# Altium schematic sheet RobotCtrl_V2_Mother-board.SchDoc
size A3; Author: Power Lin; DocumentNumber: 1; SheetNumber: 1; SheetTotal: 1; Website: wiki-power.com
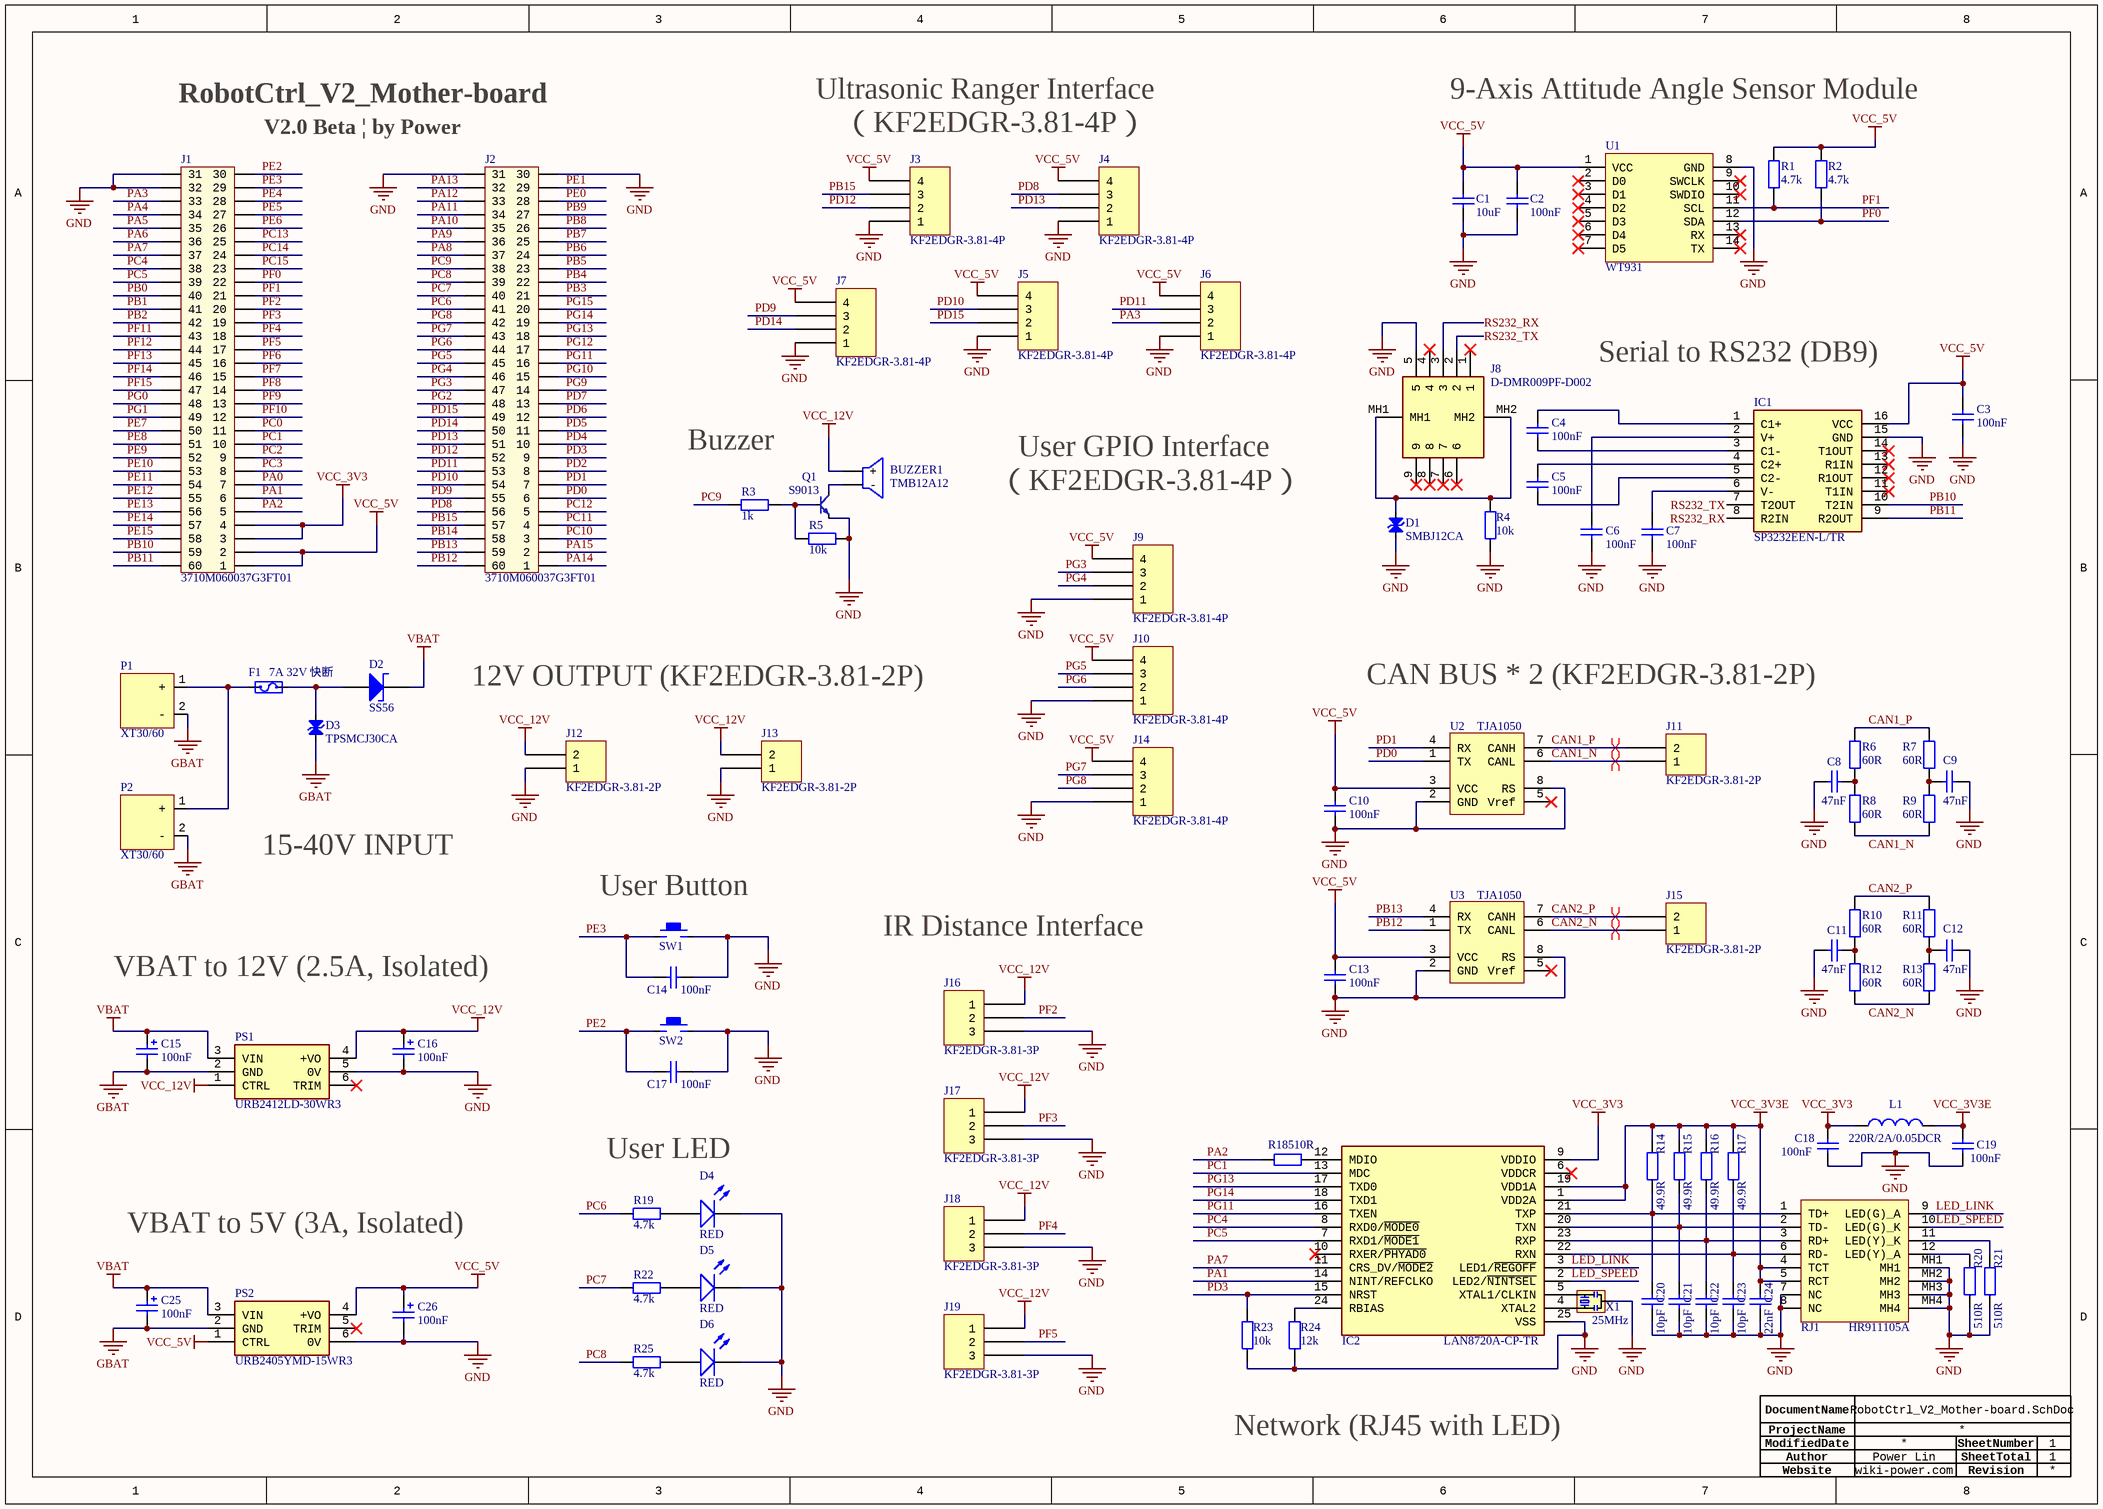
[diagram p0: RobotCtrl_V2_Mother-board.SchDoc]

## Parts
BUZZER1  TMB12A12  [DIP,P=7.6mm]
C1  10uF  [CAP-0603]
C2  100nF  [CAP-0603]
C3  100nF  [CAP-0603]
C4  100nF  [CAP-0603]
C5  100nF  [CAP-0603]
C6  100nF  [CAP-0603]
C7  100nF  [CAP-0603]
C8  47nF  [CAP-0603]
C9  47nF  [CAP-0603]
C10  100nF  [CAP-0603]
C11  47nF  [CAP-0603]
C12  47nF  [CAP-0603]
C13  100nF  [CAP-0603]
C14  100nF  [CAP-0603]
C15  100nF  [CAP-AUX-3216]
C16  100nF  [CAP-AUX-3216]
C17  100nF  [CAP-0603]
C18  100nF  [CAP-0603]
C19  100nF  [CAP-0603]
C20  10pF  [CAP-0603]
C21  10pF  [CAP-0603]
C22  10pF  [CAP-0603]
C23  10pF  [CAP-0603]
C24  22nF  [CAP-0603]
C25  100nF  [CAP-AUX-3216]
C26  100nF  [CAP-AUX-3216]
D1  SMBJ12CA  [DO-214AA/SMB]
D2  SS56  [DO-214AB/SMC]
D3  TPSMCJ30CA  [DO-214AB/SMC]
D4  RED  [LED-0603]
D5  RED  [LED-0603]
D6  RED  [LED-0603]
F1  7A 32V 快断  [FUSE_1206]
IC1  SP3232EEN-L/TR  [SOIC-16_150mil]
IC2  LAN8720A-CP-TR  [QFN-24-4x4]
J1  3710M060037G3FT01  [3710M060037G3FT01]
J2  3710M060037G3FT01  [3710M060037G3FT01]
J3  KF2EDGR-3.81-4P  [FCI 06-381-4PIN]
J4  KF2EDGR-3.81-4P  [FCI 06-381-4PIN]
J5  KF2EDGR-3.81-4P  [FCI 06-381-4PIN]
J6  KF2EDGR-3.81-4P  [FCI 06-381-4PIN]
J7  KF2EDGR-3.81-4P  [FCI 06-381-4PIN]
J8  D-DMR009PF-D002  [Through Hole,P=2.77mm]
J9  KF2EDGR-3.81-4P  [FCI 06-381-4PIN]
J10  KF2EDGR-3.81-4P  [FCI 06-381-4PIN]
J11  KF2EDGR-3.81-2P  [FCI 06-381-2PIN]
J12  KF2EDGR-3.81-2P  [FCI 06-381-2PIN]
J13  KF2EDGR-3.81-2P  [FCI 06-381-2PIN]
J14  KF2EDGR-3.81-4P  [FCI 06-381-4PIN]
J15  KF2EDGR-3.81-2P  [FCI 06-381-2PIN]
J16  KF2EDGR-3.81-3P  [FCI 06-381-3PIN]
J17  KF2EDGR-3.81-3P  [FCI 06-381-3PIN]
J18  KF2EDGR-3.81-3P  [FCI 06-381-3PIN]
J19  KF2EDGR-3.81-3P  [FCI 06-381-3PIN]
L1  220R/2A/0.05DCR  [L-0603]
P1  XT30/60  [XT60PW-M]
P2  XT30/60  [XT60PW-M]
PS1  URB2412LD-30WR3  [URB2412LD30WR3]
PS2  URB2405YMD-15WR3  [URB2405YMD15WR3]
Q1  S9013  [SOT-23-3]
R1  4.7k  [R-0603]
R2  4.7k  [R-0603]
R3  1k  [R-0603]
R4  10k  [R-0603]
R5  10k  [R-0603]
R6  60R  [R-0603]
R7  60R  [R-0603]
R8  60R  [R-0603]
R9  60R  [R-0603]
R10  60R  [R-0603]
R11  60R  [R-0603]
R12  60R  [R-0603]
R13  60R  [R-0603]
R14  49.9R  [R-0603]
R15  49.9R  [R-0603]
R16  49.9R  [R-0603]
R17  49.9R  [R-0603]
R18  510R  [R-0603]
R19  4.7k  [R-0603]
R20  510R  [R-0603]
R21  510R  [R-0603]
R22  4.7k  [R-0603]
R23  10k  [R-0603]
R24  12k  [R-0603]
R25  4.7k  [R-0603]
RJ1  HR911105A  [HR911105A]
SW1  KEY  [KEY-4P-4.2*3.4*2.5]  (value not drawn)
SW2  KEY  [KEY-4P-4.2*3.4*2.5]  (value not drawn)
U1  WT931  [WT931]
U2  TJA1050  [SOIC_8]
U3  TJA1050  [SOIC_8]
X1  25MHz  [SMD3213-3P]

## Nets
GBAT: C15.2 C25.2 D3.1 P1.2(-) P2.2(-) PS1.2(GND) PS2.2(GND)
GND: C1.2 C2.2 C3.1 C6.1 C7.1 C8.2 C9.2 C10.1 C11.2 C12.2 C13.1 C14.1 C16.2 C17.1 C18.1 C19.1 C20.1 C21.1 C22.1 C23.1 C24.1 C26.2 D1.1 D4.K D5.K D6.K IC1.15(GND) IC2.25(VSS) J1.31 J1.32 J2.30 J2.31 J3.1 J4.1 J5.1 J6.1 J7.1 J8.5 J9.1 J10.1 J12.1 J13.1 J14.1 J16.3 J17.3 J18.3 J19.3 PS1.5(0V) PS2.6(0V) Q1.2(E) R4.1 R5.1 R20.1 R21.1 R23.2 R24.2 RJ1.7(NC) RJ1.8(NC) RJ1.MH1 RJ1.MH2 RJ1.MH3 RJ1.MH4 SW1.2 SW2.2 U1.8(GND) U2.2(GND) U2.8(RS) U3.2(GND) U3.8(RS) X1.2(GND)
VBAT: C15.1 C25.1 D2.2(K) PS1.3(VIN) PS2.3(VIN)
VCC_3V3: C18.2 IC2.9(VDDIO) J1.3 J1.4 L1.1
VCC_3V3E: C19.2 C24.2 IC2.1(VDD2A) IC2.19(VDD1A) L1.2 R14.2 R15.2 R16.2 R17.2 RJ1.4(TCT) RJ1.5(RCT)
VCC_5V: C1.1 C2.1 C3.2 C10.2 C13.2 C26.1 IC1.16(VCC) J1.1 J1.2 J3.4 J4.4 J5.4 J6.4 J7.4 J9.4 J10.4 J14.4 PS2.1(CTRL) PS2.4(+VO) R1.2 R2.2 U1.1(VCC) U2.3(VCC) U3.3(VCC)
VCC_12V: BUZZER1.1(+) C16.1 J12.2 J13.2 J16.1 J17.1 J18.1 J19.1 PS1.1(CTRL) PS1.4(+VO)
CAN1_N: J11.1 R8.2 R9.1 U2.6(CANL)
CAN1_P: J11.2 R6.1 R7.2 U2.7(CANH)
CAN2_N: J15.1 R12.2 R13.1 U3.6(CANL)
CAN2_P: J15.2 R10.1 R11.2 U3.7(CANH)
LED_LINK: IC2.3(LED1/~{REGOFF}) RJ1.9(LED(G)_A)
LED_SPEED: IC2.2(LED2/~{NINTSEL}) RJ1.10(LED(G)_K)
PA0: J1.7
PA1: IC2.14(NINT/REFCLKO) J1.6
PA2: J1.5 R18.2
PA3: J1.33 J6.2
PA4: J1.34
PA5: J1.35
PA6: J1.36
PA7: IC2.11(CRS_DV/~{MODE2}) J1.37
PA8: J2.37
PA9: J2.36
PA10: J2.35
PA11: J2.34
PA12: J2.33
PA13: J2.32
PA14: J2.1
PA15: J2.2
PB0: J1.40
PB1: J1.41
PB2: J1.42
PB3: J2.21
PB4: J2.22
PB5: J2.23
PB6: J2.24
PB7: J2.25
PB8: J2.26
PB9: J2.27
PB10: IC1.10(T2IN) J1.59
PB11: IC1.9(R2OUT) J1.60
PB12: J2.60 U3.1(TX)
PB13: J2.59 U3.4(RX)
PB14: J2.58
PB15: J2.57 J3.3
PC0: J1.11
PC1: IC2.13(MDC) J1.10
PC2: J1.9
PC3: J1.8
PC4: IC2.8(RXD0/~{MODE0}) J1.38
PC5: IC2.7(RXD1/~{MODE1}) J1.39
PC6: J2.41 R19.2
PC7: J2.40 R22.2
PC8: J2.39 R25.2
PC9: J2.38 R3.1
PC10: J2.3
PC11: J2.4
PC12: J2.5
PC13: J1.25
PC14: J1.24
PC15: J1.23
PD0: J2.6 U2.1(TX)
PD1: J2.7 U2.4(RX)
PD2: J2.8
PD3: IC2.15(NRST) J2.9 R23.1
PD4: J2.10
PD5: J2.11
PD6: J2.12
PD7: J2.13
PD8: J2.56 J4.3
PD9: J2.55 J7.3
PD10: J2.54 J5.3
PD11: J2.53 J6.3
PD12: J2.52 J3.2
PD13: J2.51 J4.2
PD14: J2.50 J7.2
PD15: J2.49 J5.2
PE0: J2.28
PE1: J2.29
PE2: C17.2 J1.30 SW2.1
PE3: C14.2 J1.29 SW1.1
PE4: J1.28
PE5: J1.27
PE6: J1.26
PE7: J1.50
PE8: J1.51
PE9: J1.52
PE10: J1.53
PE11: J1.54
PE12: J1.55
PE13: J1.56
PE14: J1.57
PE15: J1.58
PF0: J1.22 R2.1 U1.12(SDA)
PF1: J1.21 R1.1 U1.11(SCL)
PF2: J1.20 J16.2
PF3: J1.19 J17.2
PF4: J1.18 J18.2
PF5: J1.17 J19.2
PF6: J1.16
PF7: J1.15
PF8: J1.14
PF9: J1.13
PF10: J1.12
PF11: J1.43
PF12: J1.44
PF13: J1.45
PF14: J1.46
PF15: J1.47
PG0: J1.48
PG1: J1.49
PG2: J2.48
PG3: J2.47 J9.3
PG4: J2.46 J9.2
PG5: J2.45 J10.3
PG6: J2.44 J10.2
PG7: J2.43 J14.3
PG8: J2.42 J14.2
PG9: J2.14
PG10: J2.15
PG11: IC2.16(TXEN) J2.16
PG12: J2.17
PG13: IC2.17(TXD0) J2.18
PG14: IC2.18(TXD1) J2.19
PG15: J2.20
RS232_RX: IC1.8(R2IN) J8.3
RS232_TX: IC1.7(T2OUT) J8.2
NetBUZZER1_2: BUZZER1.2(-) Q1.3(C)
NetC4_1: C4.1 IC1.3(C1-)
NetC4_2: C4.2 IC1.1(C1+)
NetC5_1: C5.1 IC1.5(C2-)
NetC5_2: C5.2 IC1.4(C2+)
NetC6_2: C6.2 IC1.2(V+)
NetC7_2: C7.2 IC1.6(V-)
NetC8_1: C8.1 R6.2 R8.1
NetC9_1: C9.1 R7.1 R9.2
NetC11_1: C11.1 R10.2 R12.1
NetC12_1: C12.1 R11.1 R13.2
NetC20_2: C20.2 IC2.21(TXP) R14.1 RJ1.1(TD+)
NetC21_2: C21.2 IC2.20(TXN) R15.1 RJ1.2(TD-)
NetC22_2: C22.2 IC2.23(RXP) R16.1 RJ1.3(RD+)
NetC23_2: C23.2 IC2.22(RXN) R17.1 RJ1.6(RD-)
NetD1_2: D1.2 J8.MH1 J8.MH2 R4.2
NetD2_1: D2.1(A) D3.2 F1.2
NetD4_A: D4.A R19.1
NetD5_A: D5.A R22.1
NetD6_A: D6.A R25.1
NetF1_1: F1.1 P1.1(+) P2.1(+)
NetIC2_4: IC2.4(XTAL2) X1.1(OSC1)
NetIC2_5: IC2.5(XTAL1/CLKIN) X1.3(OSC2)
NetIC2_12: IC2.12(MDIO) R18.1
NetIC2_24: IC2.24(RBIAS) R24.1
NetQ1_1: Q1.1(B) R3.2 R5.2
NetR20_2: R20.2 RJ1.12(LED(Y)_A)
NetR21_2: R21.2 RJ1.11(LED(Y)_K)

Not connected (* = marked no-connect by the designer): IC1 11(T1IN)* 12(R1OUT)* 13(R1IN)* 14(T1OUT)*; IC2 6(VDDCR)* 10(RXER/~{PHYAD0})*; J8 1* 4* 6* 7* 8* 9*; PS1 6(TRIM)*; PS2 5(TRIM)*; U1 2(D0)* 3(D1)* 4(D2)* 5(D3)* 6(D4)* 7(D5)* 9(SWCLK)* 10(SWDIO)* 13(RX)* 14(TX)*; U2 5(Vref)*; U3 5(Vref)*

## Layout directives
differential pair: CAN1_N, CAN1_P, CAN2_N, CAN2_P

## Notes on the sheet
- RobotCtrl_V2_Mother-board
- Ultrasonic Ranger Interface
- 9-Axis Attitude Angle Sensor Module
- V2.0 Beta | by Power
- （KF2EDGR-3.81-4P）
- Serial to RS232 (DB9)
- Buzzer
- User GPIO Interface
- 12V OUTPUT (KF2EDGR-3.81-2P)
- CAN BUS * 2 (KF2EDGR-3.81-2P)
- 15-40V INPUT
- (near SW1) User Button
- VBAT to 12V (2.5A, Isolated)
- IR Distance Interface
- User LED
- VBAT to 5V (3A, Isolated)
- Network (RJ45 with LED)
- Author
- DocumentName
- ModifiedDate
- ProjectName
- SheetNumber
- SheetTotal
- Website
- Revision

## Library data of the parts
BUZZER1 = BUZZER: TMB12A12 有源蜂鸣器
C1-C14 C17-C24 = CAP: 贴片电容; ComponentLink1Description: 供应商链接; ComponentLink1URL: http://www.szlcsc.com/product/details_53938.html; Package: 0402; Supplier: LC; SuppliersPartNumber: C52923
C15 C16 C25 C26 = CAP-POL: KM101M050F115A; ComponentLink1Description: 供应商链接; ComponentLink1URL: http://www.szlcsc.com/product/details_16815.html; Package: 3528; Supplier: LC; SuppliersPartNumber: C16133
D1 D3 = TVS_C
D2 = DIODE_Schottky: 肖特基二极管
D4-D6 = LED: 发光二极管; pin to pad: A>1 K>2; ComponentLink1Description: 供应商链接; ComponentLink1URL: http://www.szlcsc.com/product/details_2663.html; Package: 0603; Supplier: LC; SuppliersPartNumber: C2290
F1 = Fuse: 0437007.WR
IC1 = SP3232EEN: RS232 芯片; Manufacturer_Name: MaxLinear; Datasheet Link: https://www.maxlinear.com/ds/sp3222e_sp3232e.pdf; Height: 1.75mm; Manufacturer_Part_Number: SP3232EEN-L/TR; Mouser Part Number: 701-SP3232EEN-L/TR; Mouser Price/Stock: https://www.mouser.co.uk/ProductDetail/MaxLinear/SP3232EEN-L-TR?qs=Hy8V1%2FADhVKNh9v9NvoeCw%3D%3D; Arrow Part Number: SP3232EEN-L/TR; Arrow Price/Stock: https://www.arrow.com/en/products/sp3232een-ltr/maxlinear-inc
IC2 = LAN8720A-CP-TR: Integrated Circuit; Manufacturer_Name: Microchip; Datasheet Link: https://componentsearchengine.com/Datasheets/1/LAN8720A-CP-TR.pdf; Height: 1mm; Manufacturer_Part_Number: LAN8720A-CP-TR; Mouser Part Number: 886-LAN8720A-CP-TR; Mouser Price/Stock: https://www.mouser.co.uk/ProductDetail/Microchip-Technology/LAN8720A-CP-TR?qs=pA5MXup5wxG3QiSvrqf%2FHQ%3D%3D; Arrow Part Number: LAN8720A-CP-TR; Arrow Price/Stock: https://www.arrow.com/en/products/lan8720a-cp-tr/microchip-technology?region=nac
J1 J2 = 3710M/F: B2B Connector
J3-J7 J9 J10 J14 = KF2EDGR-3.81-4P: TERM BLOCK HDR 4POS 90DEG 3.81MM; Part Number: OQ0432510000G; Manufacturer: Amphenol Anytek; Voltage - UL: 300V; Header Orientation: 90°, Right Angle; Current - UL: 10A; Positions Per Level: 4; Pitch: 0.150" (3.81mm); Number of Levels: 1; Operating Temperature: -40°C ~ 115°C; Type: Header, Male Pins, Shrouded (4 Side); Contact Mating Finish: Tin; Minimum Order: 1; ComponentLink1Description: Datasheet; Color: Green; Series: 06-381; Lifecycle Status: 0; Mounting Type: Through Hole; Number of Positions: 4; Part Status: Active; Packaging: Bulk; Termination Style: Solder; LastUpdated: 2019-12-16 19:15:03.463; ComponentLink1URL: http://portal.fciconnect.com/Comergent//fci/drawing/oqxx32x100j0g.pdf; Price: 0.71; Manufacturer Part Number: OQ0432510000G; Component Type: 接线端子
J8 = DB9: D-Sub 连接器; Manufacturer_Name: TE Connectivity; Manufacturer_Part_Number: 5747844-5; Datasheet Link: http://www.te.com/commerce/DocumentDelivery/DDEController?Action=srchrtrv&DocNm=82068_AMPLIMITE_Right-Angle_Posted_Conn&DocType=Catalog+Section&DocLang=English&PartCntxt=; Height: 12.9286mm; Mouser Part Number: 571-5747844-5; Mouser Price/Stock: https://www.mouser.co.uk/ProductDetail/TE-Connectivity/5747844-5?qs=x6EjVpvqMVPrkQsJHUlJGw%3D%3D; Arrow Part Number: 5747844-5; Arrow Price/Stock: https://www.arrow.com/en/products/5747844-5/te-connectivity
J11-J13 J15 = KF2EDGR-3.81-2P: TERM BLOCK HDR 2POS 90DEG 3.81MM; Part Number: OQ0232510000G; Manufacturer: Amphenol Anytek; Manufacturer: Amphenol; Number of Levels: 1; Number of Positions: 2; Header Orientation: 90°, Right Angle; Current - UL: 10A; Pitch: 0.150" (3.81mm); Voltage - UL: 300V; Lifecycle Status: 0; ComponentLink1Description: Datasheet; Series: 06-381; Color: Green; Termination Style: Solder; Minimum Order: 1; Type: Header, Male Pins, Shrouded (4 Side); LastUpdated: 2019-12-16 19:14:30.110; Operating Temperature: -40°C ~ 115°C; Packaging: Bulk; ComponentLink1URL: http://portal.fciconnect.com/Comergent//fci/drawing/oqxx32x100j0g.pdf; Price: 0.49; Mounting Type: Through Hole; Positions Per Level: 2; Contact Mating Finish: Tin; Part Status: Active; Manufacturer Part Number: OQ0232510000G; Component Type: 接线端子
J16-J19 = KF2EDGR-3.81-3P: TERM BLOCK HDR 3POS 90DEG 3.81MM; Manufacturer: Amphenol Anytek; Part Number: OQ0332510000G; Current - UL: 10A; Positions Per Level: 3; Number of Levels: 1; Voltage - UL: 300V; Pitch: 0.150" (3.81mm); Header Orientation: 90°, Right Angle; ComponentLink1Description: Datasheet; Part Status: Active; Type: Header, Male Pins, Shrouded (4 Side); Contact Mating Finish: Tin; Termination Style: Solder; Minimum Order: 1; Series: 06-381; Lifecycle Status: 0; Operating Temperature: -40°C ~ 115°C; Color: Green; Packaging: Bulk; Number of Positions: 3; Price: 0.53; Mounting Type: Through Hole; LastUpdated: 2019-12-16 19:14:45.877; ComponentLink1URL: http://portal.fciconnect.com/Comergent//fci/drawing/oqxx32x100j0g.pdf; Manufacturer Part Number: OQ0332510000G; Component Type: 接线端子
L1 = BEAD: BLM18KG221SN1D; ComponentLink1Description: 供应商链接; ComponentLink1URL: http://www.szlcsc.com/product/details_33003.html; Package: 0402; Supplier: LC; SuppliersPartNumber: C32041
PS1 = URB2412LD-30WR3: 金升阳隔离电源; Manufacturer_Name: Mornsun; Manufacturer_Part_Number: URB2412LD-30WHR3; Datasheet Link: https://4donline.ihs.com/images/VipMasterIC/IC/MNSN/MNSN-S-A0002273855/MNSN-S-A0002273855-1.pdf?hkey=EF798316E3902B6ED9A73243A3159BB0; Height: 16.8mm
PS2 = URB2405YMD-15WR3: 金升阳隔离电源; Manufacturer_Name: Mornsun; Manufacturer_Part_Number: URB2405YMD-10WR3; Datasheet Link: https://www.mornsun-power.com/html/pdf/URB2405YMD-10WR3.html; Height: 12.2mm
Q1 = BJT_NPN
R1-R25 = RES: 贴片电阻; Package: 0805; Supplier: LC; SuppliersPartNumber: C17798
RJ1 = RJ45_LED
SW1 SW2 = KEY: 按键开关
U1 = WT931: 陀螺仪模组
U2 U3 = TJA1050: CAN 控制器（5V）
X1 = XTAL: CSTCE25M00G51-R0